# EAGLE design snc98_Display_15x7-Seg_3-digit_LTD040 (EAGLE 6.6.0)

## Sheet 1 of 2
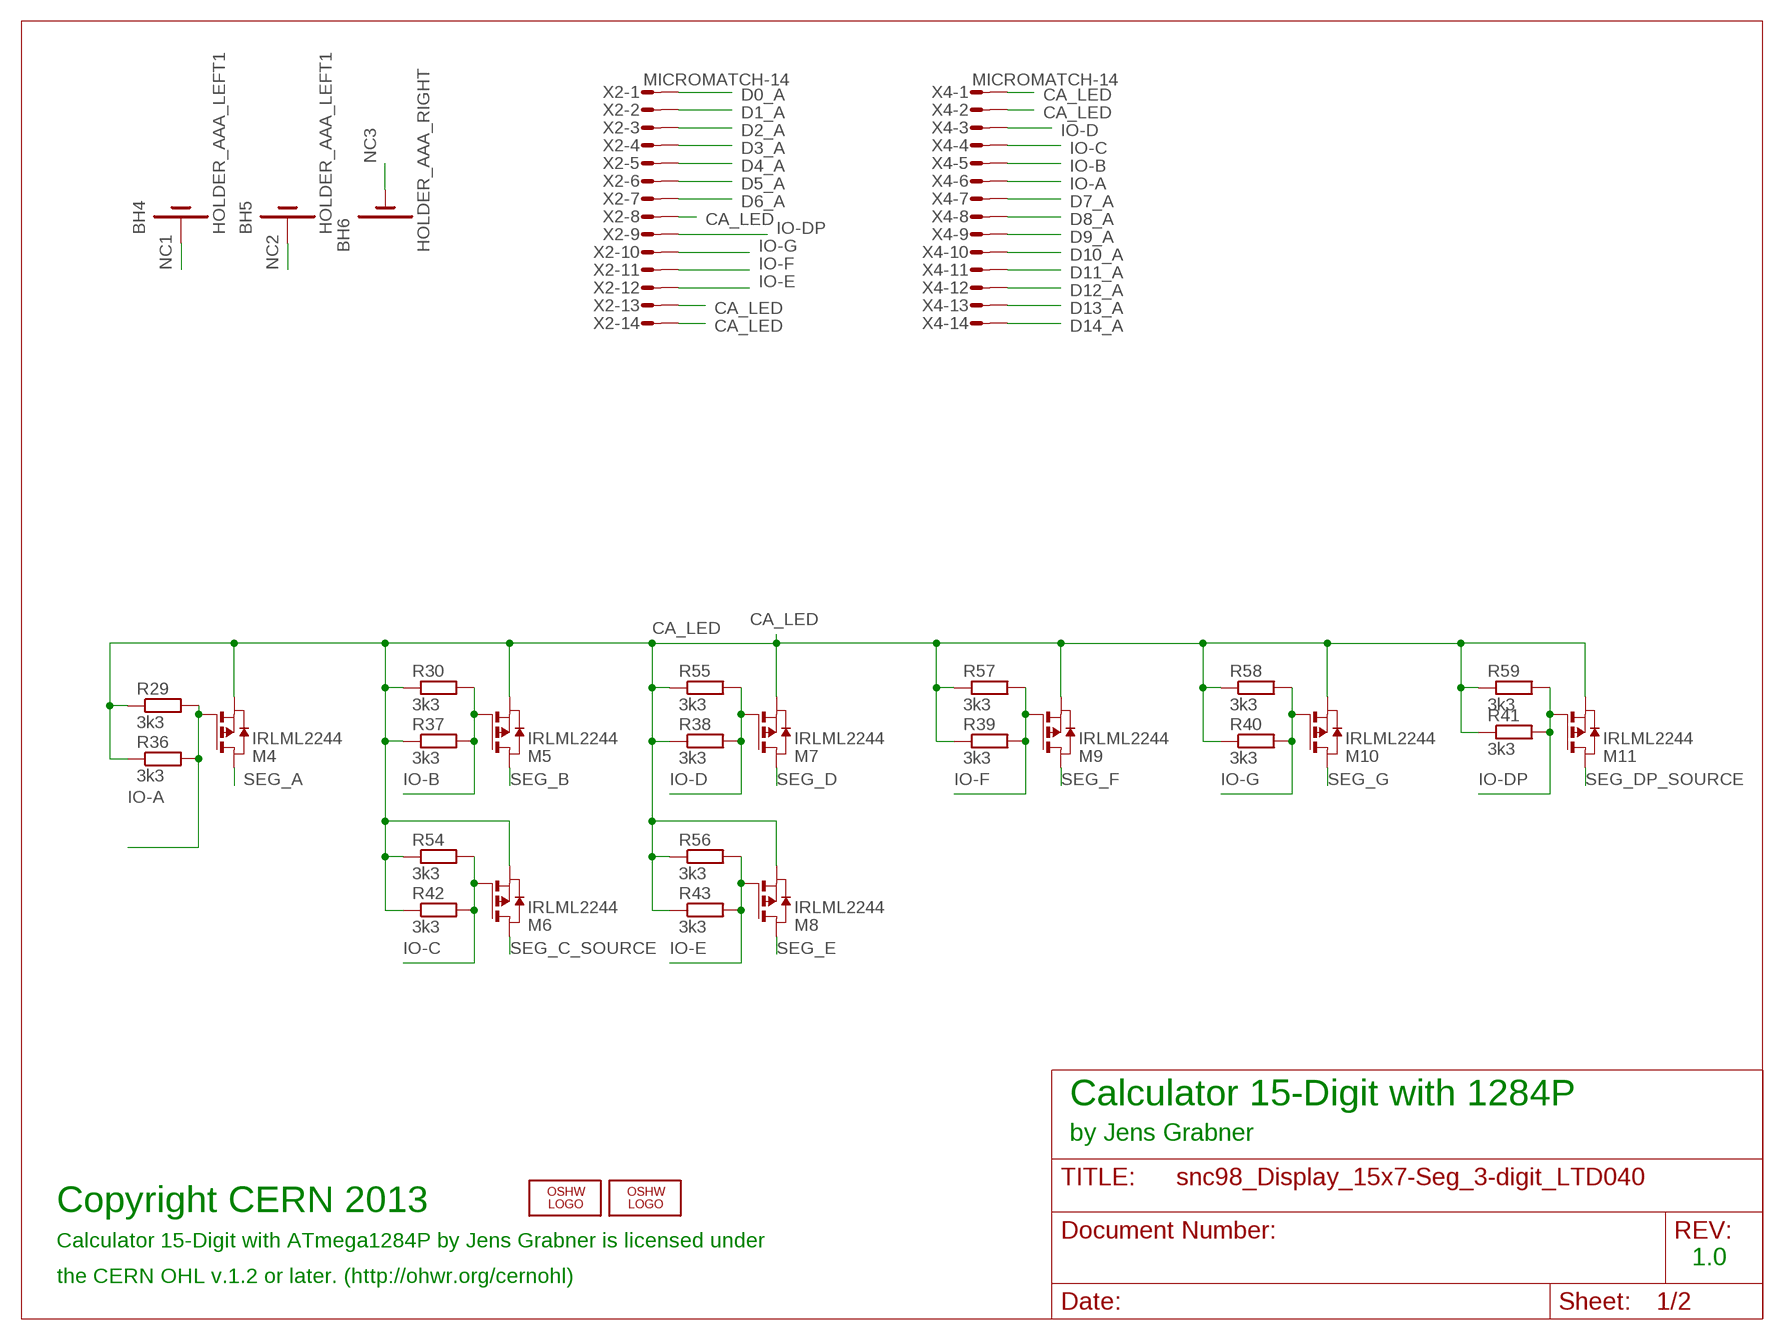
[diagram p0: schematic, sheet 1]

### Parts
BH4  HOLDER_AAA_LEFT1  [BATTERY-AAA-LEFT]
BH5  HOLDER_AAA_LEFT1  [BATTERY-AAA-LEFT]
BH6  HOLDER_AAA_RIGHT  [BATTERY-AAA-RIGHT]
LOGO1  OSHW_LOGO_8MILX0150-NT  [OSHW_8X150_NOTEXT]
LOGO3  OSHW_LOGO_6MILX0100-NT  [OSHW_6X100_NOTEXT]
M4  IRLML2244  IRLML6402  [SOT-23]
M5  IRLML2244  IRLML6402  [SOT-23]
M6  IRLML2244  IRLML6402  [SOT-23]
M7  IRLML2244  IRLML6402  [SOT-23]
M8  IRLML2244  IRLML6402  [SOT-23]
M9  IRLML2244  IRLML6402  [SOT-23]
M10  IRLML2244  IRLML6402  [SOT-23]
M11  IRLML2244  IRLML6402  [SOT-23]
R29  3k3  R-EU_0204/5  [0204/5]
R30  3k3  R-EU_0204/5  [0204/5]
R36  3k3  R-EU_R1206  [R1206]
R37  3k3  R-EU_R1206  [R1206]
R38  3k3  R-EU_R1206  [R1206]
R39  3k3  R-EU_R1206  [R1206]
R40  3k3  R-EU_R1206  [R1206]
R41  3k3  R-EU_R1206  [R1206]
R42  3k3  R-EU_R1206  [R1206]
R43  3k3  R-EU_R1206  [R1206]
R54  3k3  R-EU_0204/5  [0204/5]
R55  3k3  R-EU_0204/5  [0204/5]
R56  3k3  R-EU_0204/5  [0204/5]
R57  3k3  R-EU_0204/5  [0204/5]
R58  3k3  R-EU_0204/5  [0204/5]
R59  3k3  R-EU_0204/5  [0204/5]
X2  MICROMATCH-14  [MICROMATCH-14]
X4  MICROMATCH-14  [MICROMATCH-14]

### Nets
CA_LED: M4.2(S) M5.2(S) M6.2(S) M7.2(S) M8.2(S) M9.2(S) M10.2(S) M11.2(S) R29.1 R30.1 R36.1 R37.1 R38.1 R39.1 R40.1 R41.1 R42.1 R43.1 R54.1 R55.1 R56.1 R57.1 R58.1 R59.1 X2.8 X2.13 X2.14 X4.1 X4.2 ; also sheet 2
D0_A: X2.1 ; also sheet 2
D1_A: X2.2 ; also sheet 2
D2_A: X2.3 ; also sheet 2
D3_A: X2.4 ; also sheet 2
D4_A: X2.5 ; also sheet 2
D5_A: X2.6 ; also sheet 2
D6_A: X2.7 ; also sheet 2
D7_A: X4.7 ; also sheet 2
D8_A: X4.8 ; also sheet 2
D9_A: X4.9 ; also sheet 2
D10_A: X4.10 ; also sheet 2
D11_A: X4.11 ; also sheet 2
D12_A: X4.12 ; also sheet 2
D13_A: X4.13 ; also sheet 2
D14_A: X4.14 ; also sheet 2
IO-A: M4.1(G) R29.2 R36.2 X4.6 ; also sheet 2
IO-B: M5.1(G) R30.2 R37.2 X4.5 ; also sheet 2
IO-C: M6.1(G) R42.2 R54.2 X4.4 ; also sheet 2
IO-D: M7.1(G) R38.2 R55.2 X4.3 ; also sheet 2
IO-DP: M11.1(G) R41.2 R59.2 X2.9 ; also sheet 2
IO-E: M8.1(G) R43.2 R56.2 X2.12 ; also sheet 2
IO-F: M9.1(G) R39.2 R57.2 X2.11 ; also sheet 2
IO-G: M10.1(G) R40.2 R58.2 X2.10 ; also sheet 2
NC1: BH4.P1(+) BH4.P2(+) BH4.P3(+) BH4.P4(+)
NC2: BH5.P1(+) BH5.P2(+) BH5.P3(+) BH5.P4(+)
NC3: BH6.M1(-) BH6.M2(-) BH6.M3(-) BH6.M4(-)
SEG_A: M4.3(D) ; also sheet 2
SEG_B: M5.3(D) ; also sheet 2
SEG_C_SOURCE: M6.3(D) ; also sheet 2
SEG_D: M7.3(D) ; also sheet 2
SEG_DP_SOURCE: M11.3(D) ; also sheet 2
SEG_E: M8.3(D) ; also sheet 2
SEG_F: M9.3(D) ; also sheet 2
SEG_G: M10.3(D) ; also sheet 2

### Notes on the sheet
- Calculator 15-Digit with 1284P
- by Jens Grabner
- Copyright CERN 2013
- Calculator 15-Digit with ATmega1284P by Jens Grabner is licensed under
- 1.0
- the CERN OHL v.1.2 or later. (http://ohwr.org/cernohl)

## Sheet 2 of 2
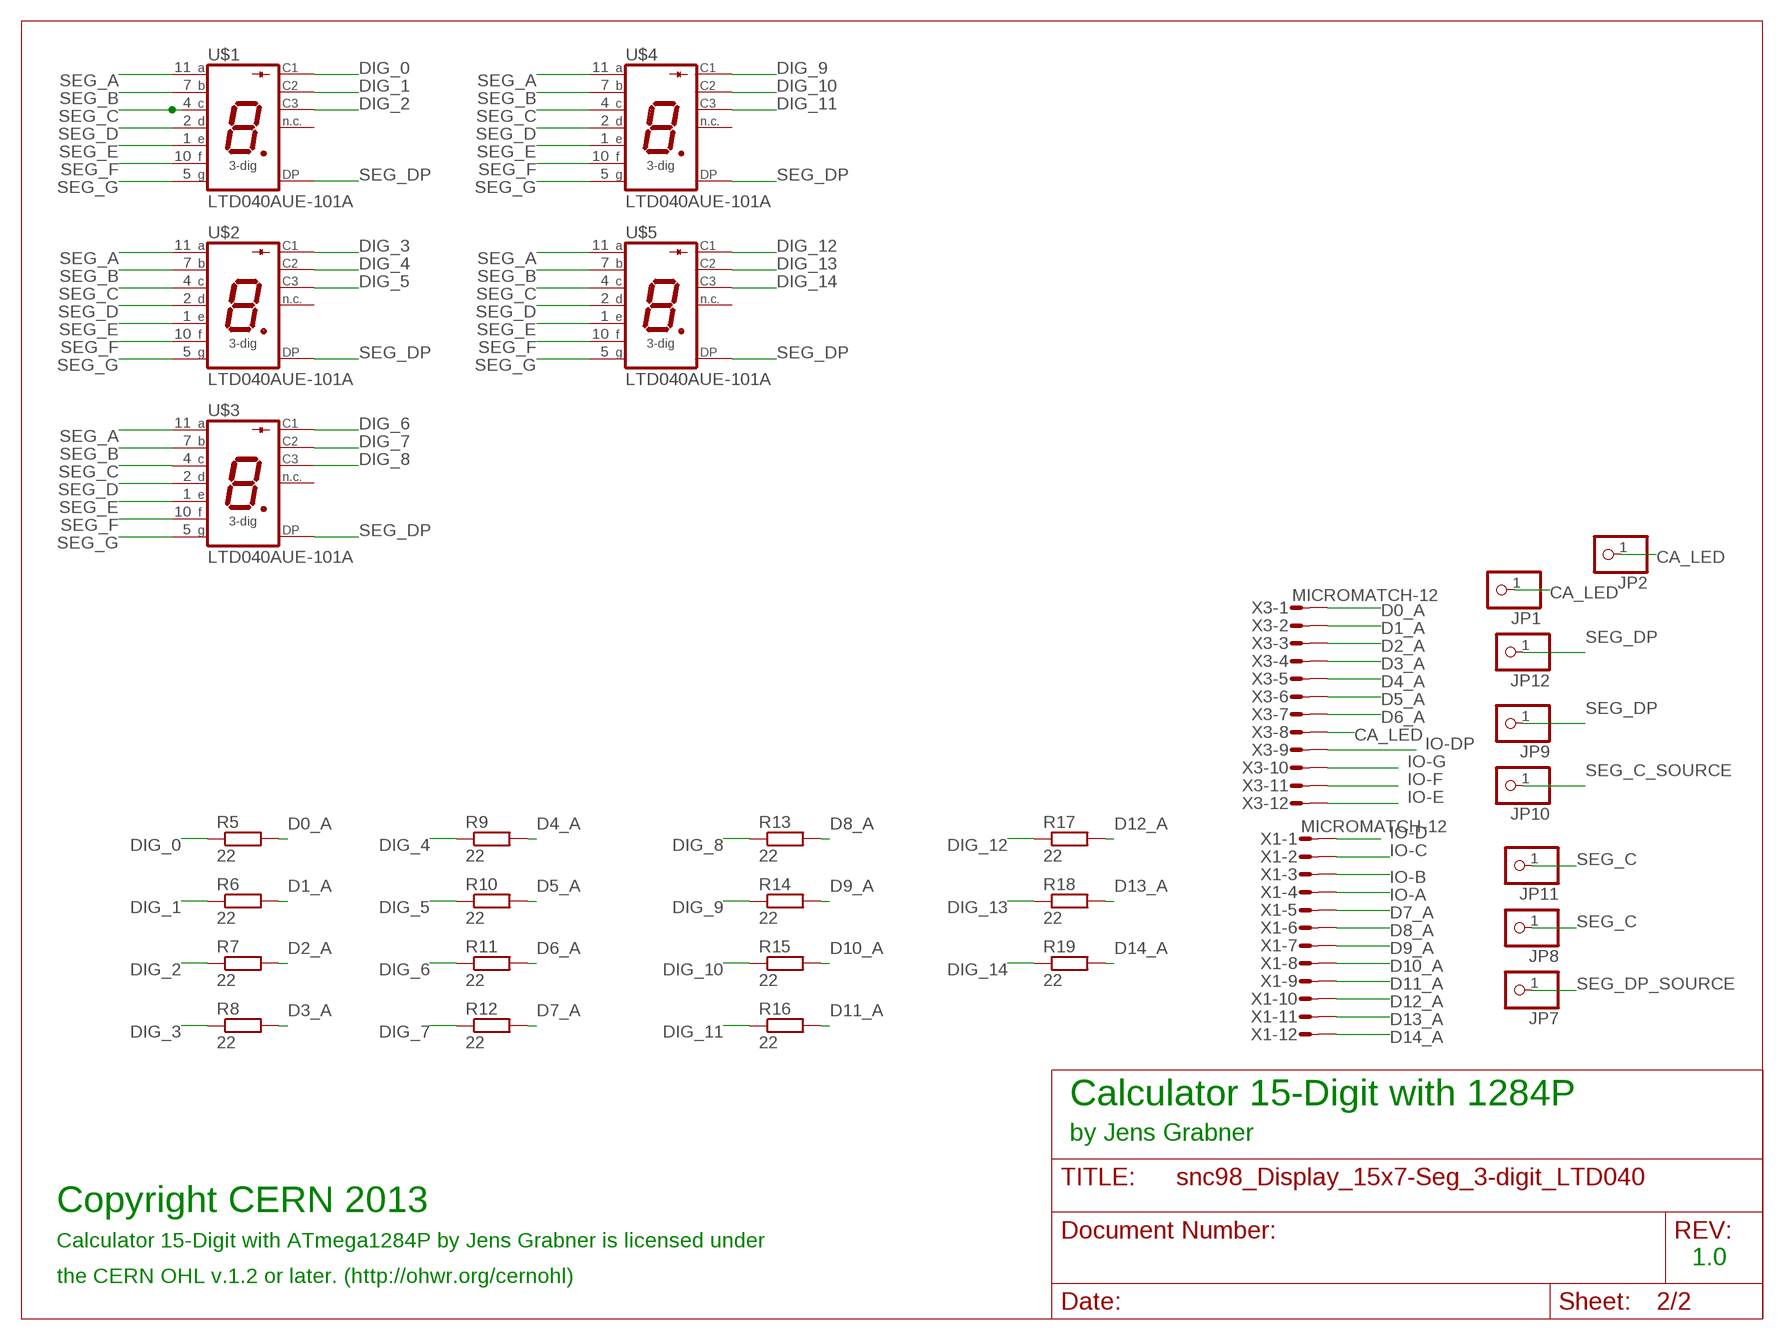
[diagram p1: schematic, sheet 2]

### Parts
JP1  PINHD-1X1  [1X01]
JP2  PINHD-1X1  [1X01]
JP7  PINHD-1X1  [1X01]
JP8  PINHD-1X1  [1X01]
JP9  PINHD-1X1  [1X01]
JP10  PINHD-1X1  [1X01]
JP11  PINHD-1X1  [1X01]
JP12  PINHD-1X1  [1X01]
R5  22  R-EU_R1210  [R1210]
R6  22  R-EU_R1210  [R1210]
R7  22  R-EU_R1210  [R1210]
R8  22  R-EU_R1210  [R1210]
R9  22  R-EU_R1210  [R1210]
R10  22  R-EU_R1210  [R1210]
R11  22  R-EU_R1210  [R1210]
R12  22  R-EU_R1210  [R1210]
R13  22  R-EU_R1210  [R1210]
R14  22  R-EU_R1210  [R1210]
R15  22  R-EU_R1210  [R1210]
R16  22  R-EU_R1210  [R1210]
R17  22  R-EU_R1210  [R1210]
R18  22  R-EU_R1210  [R1210]
R19  22  R-EU_R1210  [R1210]
U$1  LTD040AUE-101A  [LTD040AUE-101A]
U$2  LTD040AUE-101A  [LTD040AUE-101A]
U$3  LTD040AUE-101A  [LTD040AUE-101A]
U$4  LTD040AUE-101A  [LTD040AUE-101A]
U$5  LTD040AUE-101A  [LTD040AUE-101A]
X1  MICROMATCH-12  [MICROMATCH-12]
X3  MICROMATCH-12  [MICROMATCH-12]

### Nets
CA_LED: JP1.1 JP2.1 X3.8 ; also sheet 1
D0_A: R5.2 X3.1 ; also sheet 1
D1_A: R6.2 X3.2 ; also sheet 1
D2_A: R7.2 X3.3 ; also sheet 1
D3_A: R8.2 X3.4 ; also sheet 1
D4_A: R9.2 X3.5 ; also sheet 1
D5_A: R10.2 X3.6 ; also sheet 1
D6_A: R11.2 X3.7 ; also sheet 1
D7_A: R12.2 X1.5 ; also sheet 1
D8_A: R13.2 X1.6 ; also sheet 1
D9_A: R14.2 X1.7 ; also sheet 1
D10_A: R15.2 X1.8 ; also sheet 1
D11_A: R16.2 X1.9 ; also sheet 1
D12_A: R17.2 X1.10 ; also sheet 1
D13_A: R18.2 X1.11 ; also sheet 1
D14_A: R19.2 X1.12 ; also sheet 1
DIG_0: R5.1 U$1.12(C1)
DIG_1: R6.1 U$1.9(C2)
DIG_2: R7.1 U$1.8(C3)
DIG_3: R8.1 U$2.12(C1)
DIG_4: R9.1 U$2.9(C2)
DIG_5: R10.1 U$2.8(C3)
DIG_6: R11.1 U$3.12(C1)
DIG_7: R12.1 U$3.9(C2)
DIG_8: R13.1 U$3.8(C3)
DIG_9: R14.1 U$4.12(C1)
DIG_10: R15.1 U$4.9(C2)
DIG_11: R16.1 U$4.8(C3)
DIG_12: R17.1 U$5.12(C1)
DIG_13: R18.1 U$5.9(C2)
DIG_14: R19.1 U$5.8(C3)
IO-A: X1.4 ; also sheet 1
IO-B: X1.3 ; also sheet 1
IO-C: X1.2 ; also sheet 1
IO-D: X1.1 ; also sheet 1
IO-DP: X3.9 ; also sheet 1
IO-E: X3.12 ; also sheet 1
IO-F: X3.11 ; also sheet 1
IO-G: X3.10 ; also sheet 1
SEG_A: U$1.11(A) U$2.11(A) U$3.11(A) U$4.11(A) U$5.11(A) ; also sheet 1
SEG_B: U$1.7(B) U$2.7(B) U$3.7(B) U$4.7(B) U$5.7(B) ; also sheet 1
SEG_C: JP8.1 JP11.1 U$1.4(C) U$2.4(C) U$3.4(C) U$4.4(C) U$5.4(C)
SEG_C_SOURCE: JP10.1 ; also sheet 1
SEG_D: U$1.2(D) U$2.2(D) U$3.2(D) U$4.2(D) U$5.2(D) ; also sheet 1
SEG_DP: JP9.1 JP12.1 U$1.3(DP) U$2.3(DP) U$3.3(DP) U$4.3(DP) U$5.3(DP)
SEG_DP_SOURCE: JP7.1 ; also sheet 1
SEG_E: U$1.1(E) U$2.1(E) U$3.1(E) U$4.1(E) U$5.1(E) ; also sheet 1
SEG_F: U$1.10(F) U$2.10(F) U$3.10(F) U$4.10(F) U$5.10(F) ; also sheet 1
SEG_G: U$1.5(G) U$2.5(G) U$3.5(G) U$4.5(G) U$5.5(G) ; also sheet 1
Unconnected: U$1.6 U$2.6 U$3.6 U$4.6 U$5.6

### Notes on the sheet
- Calculator 15-Digit with 1284P
- by Jens Grabner
- Copyright CERN 2013
- Calculator 15-Digit with ATmega1284P by Jens Grabner is licensed under
- 1.0
- the CERN OHL v.1.2 or later. (http://ohwr.org/cernohl)

## Library data of the parts
BH4 BH5 = SparkFun-Electromechanical:HOLDER_AAA_LEFT
BH6 = SparkFun-Electromechanical:HOLDER_AAA_RIGHT
JP1 JP2 JP7-JP12 = adafruit:PINHD-1X1: Pin header 1x1 for 0.1" spacing With round pins
LOGO1 = ohw-logo:OSHW_LOGO_8MIL
LOGO3 = ohw-logo:OSHW_LOGO_6MIL
M4-M11 = IRLML6402:IRLML6402
R5-R19 R29 R30 R36-R43 R54-R59 = rcl:R-EU_: RESISTOR, European symbol
U$1-U$5 = display_LTD:LTD040AUE-101A: LTD040AUE-101A
X1 X3 = Con-amp-micromatch:MICROMATCH-12: MicroMaTch 12 8-215464-2 / 1-215464-2 Drawing Number C-215464 DDEController.pdf; MF: FARNELL; MPN: 8-215464-2; OC_FARNELL: 3784666; OC_NEWARK: 95H9857
X2 X4 = Con-amp-micromatch:MICROMATCH-14: MicroMaTch 14 8-215464-4 / 1-215464-4 Drawing Number C-215464 DDEController.pdf; MF: FARNELL; MPN: 8-215464-4; OC_FARNELL: 3784678; OC_NEWARK: 19J6431

## Board
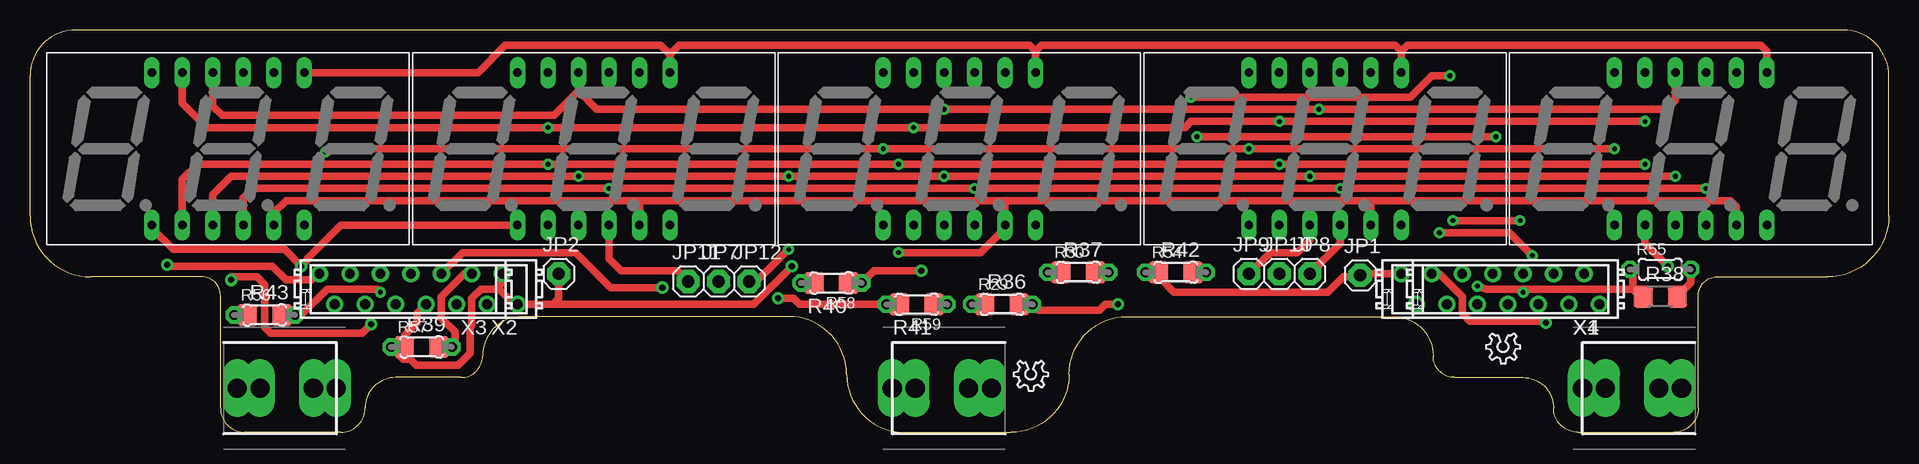
[diagram p2: board, top side]
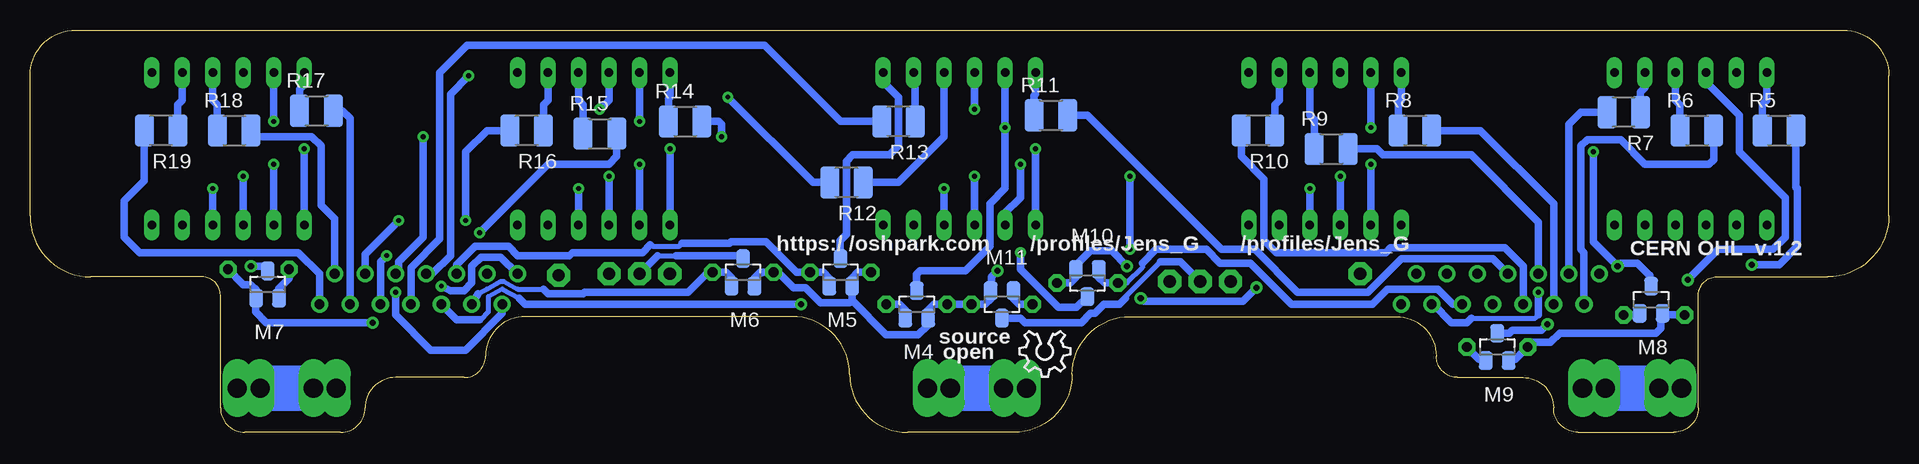
[diagram p3: board, bottom side, seen from below]

Size 154.94 x 33.53 mm. Coordinates in mm from the lower left corner, seen from the top.
Outline: 154.94,29.72 arc90 151.13,33.53 3.81,33.53 arc90 0,29.72 0,18.03 arc90 5.08,12.95 14.35,12.95 arc-90 15.88,11.43 15.88,2.03 arc90 17.91,0 25.91,0 arc90 27.94,2.03 arc-90 30.48,4.57 35.94,4.57 arc90 37.72,6.35 arc-90 41.02,9.65 63.25,9.65 arc-90 68.07,4.83 arc90 72.9,0 81.79,0 arc90 86.61,4.83 arc-90 91.44,9.65 113.67,9.65 arc-90 116.97,6.35 arc90 118.75,4.57 124.46,4.57 arc-90 127,2.03 arc90 129.03,0 137.03,0 arc90 139.06,2.03 139.06,11.43 arc-90 140.59,12.95 149.86,12.95 arc90 154.94,18.03 154.94,29.72
Copper layers (1*16): Top 0.035mm / dielectric 1.5mm / Bottom 0.035mm
Design rules "OSHPark-8mil-2layer": minimum track width 10mil, minimum drill 15mil, track to track 8mil, track to pad 8mil, pad to pad 8mil, via to via 8mil, smd to smd 8mil, copper to edge 8mil, drill to drill 8mil, minimum pad ring 12mil, minimum via ring 10mil, stop-mask expansion 4mil, vias tented up to drill 20mil, thermal gap 10mil

### Footprints (pad centres in the part's own frame; a part is rotated, then mirrored left to right if it is on the bottom)
BATTERY-AAA-LEFT = drill 1.6 long: P1 -2.413,0; P2 3.937,0; P3 2.032,0; P4 -4.318,0
BATTERY-AAA-RIGHT = drill 1.6 long: M1 -3.937,0; M2 2.413,0; M3 4.318,0; M4 -2.032,0
1X01 = drill 1.016 pad 1.93 octagon: 1 0,0
SOT-23 = smd 1.143 x 1.524: 1 0.953,1.143; 2 -0.953,1.143; 3 0,-1.143
R1210 = smd 1.6 x 2.7: 1 -1.4,0; 2 1.4,0
0204/5 = drill 0.813 octagon: 1 -2.54,0; 2 2.54,0
R1206 = smd 1.6 x 1.803: 1 -1.422,0; 2 1.422,0
LTD040AUE-101A = drill 0.7 pad 1.27 long: 1 -6.35,-6.35; 2 -3.81,-6.35; 3 -1.27,-6.35; 4 1.27,-6.35; 5 3.81,-6.35; 6 6.35,-6.35; 8 3.81,6.35; 9 1.27,6.35; 10 -1.27,6.35; 11 -3.81,6.35; 12 -6.35,6.35 | drill 0.7 long: 7 6.35,6.35
MICROMATCH-12 = drill 0.813: 1 6.985,-1.27; 2 5.715,1.27; 3 4.445,-1.27; 4 3.175,1.27; 5 1.905,-1.27; 6 0.635,1.27; 7 -0.635,-1.27; 8 -1.905,1.27; 9 -3.175,-1.27; 10 -4.445,1.27; 11 -5.715,-1.27; 12 -6.985,1.27
MICROMATCH-14 = drill 0.813: 1 8.255,-1.27; 2 6.985,1.27; 3 5.715,-1.27; 4 4.445,1.27; 5 3.175,-1.27; 6 1.905,1.27; 7 0.635,-1.27; 8 -0.635,1.27; 9 -1.905,-1.27; 10 -3.175,1.27; 11 -4.445,-1.27; 12 -5.715,1.27; 13 -6.985,-1.27; 14 -8.255,1.27

### Placement (x,y rotation side)
BH4  133.73,3.68 0 top
BH5  76.2,3.68 0 top
BH6  21.21,3.68 0 top
JP1  110.87,13.08 0 top
JP2  44.07,13.21 0 top
JP7  57.4,12.57 0 top
JP8  106.68,13.21 0 top
JP9  101.6,13.21 0 top
JP10  104.14,13.21 0 top
JP11  54.86,12.57 0 top
JP12  59.94,12.57 0 top
LOGO1  68.22,8.43 180 bottom
LOGO2  OSHW_LOGO_6MILX0100-NT  [OSHW_6X100_NOTEXT]  84.84,5.97 180 top
LOGO3  124.21,8.26 180 top
M4  81.03,10.67 180 bottom
M5  87.38,13.34 180 bottom
M6  95.5,13.34 180 bottom
M7  135.13,12.32 180 bottom
M8  19.81,11.05 180 bottom
M9  32.64,7.11 180 bottom
M10  66.8,12.45 0 bottom
M11  73.91,10.67 0 bottom
R5  9.14,25.15 0 bottom
R6  16,25.15 0 bottom
R7  22.1,26.67 180 bottom
R8  39.5,25.15 0 bottom
R9  46.48,23.62 0 bottom
R10  52.58,25.15 180 bottom
R11  69.85,26.42 0 bottom
R12  86.87,20.83 180 bottom
R13  82.55,25.91 180 bottom
R14  100.33,25.91 0 bottom
R15  107.44,24.89 0 bottom
R16  113.54,25.15 180 bottom
R17  131.06,26.8 0 bottom
R18  137.92,25.15 0 bottom
R19  144.02,25.15 180 bottom
R29  81.03,10.67 0 top
R30  87.38,13.34 0 top
R36  81.03,10.67 0 top
R37  87.38,13.34 0 top
R38  135.89,11.3 0 top
R39  32.64,7.11 0 top
R40  66.8,12.45 180 top
R41  73.91,10.67 180 top
R42  95.5,13.34 0 top
R43  19.56,9.78 0 top
R54  95.5,13.34 0 top
R55  135.89,13.59 0 top
R56  19.56,9.78 0 top
R57  32.64,7.11 0 top
R58  66.8,12.45 180 top
R59  73.91,10.67 180 top
U$1  16.51,23.62 0 top
U$2  46.99,23.62 0 top
U$3  77.47,23.62 0 top
U$4  107.95,23.62 0 top
U$5  138.43,23.62 0 top
X1  123.83,11.94 180 top
X2  32.38,11.94 180 top
X3  31.11,11.94 180 top
X4  122.56,11.94 180 top

### Tracks (layer width: path | path; a pad name or v marks a point on that pad's centre or on a via)
CA_LED  (via drill 0.41, 0.51)
  Top 0.254: 31.75,7.62 R39.1
  Top 0.406: 36.2,6.22 36.2,6.1 | 107.31,11.81 107.31,11.68
  Top 0.61: R43.1 R56.1 | 43.56,10.67 60.33,10.67 v63.5,13.84 | 43.56,10.67 X2.14 40.39,10.67 38.99,12.06 | R36.1 R29.1 | R37.1 85.95,13.36 85.85,13.46 84.96,13.46 R30.1 | R54.1 93.7,13.31 R42.1 94.25,13.17 94.25,12.79 95.36,11.68 107.31,11.68 108.2,11.68 109.47,12.95 110.24,12.95 | X4.1 110.24,13.21 110.24,12.95 | 38.99,12.06 39.37,12.45 X2.13 | 38.99,12.06 38.86,11.94 37.59,11.94 36.83,11.18 36.83,8.89 36.7,8.76 36.7,6.6 36.2,6.1 35.69,5.59 32.21,5.59 31.7,6.1 31.11,6.1 R57.1 R39.1 | JP2.1 44.07,11.18 43.56,10.67 | R58.1 R40.1 | R58.1 68.76,12.45 | 31.7,6.63 R39.1 | 31.11,7.21 R39.1 | R41.1 R59.1 | v74.3,13.46 70.36,13.46 R58.1 | v124.46,11.68 124.33,11.94 | 124.33,11.94 121.41,11.94 v120.65,12.19 | 110.24,12.95 110.74,12.95 JP1.1 | X2.8 32.26,9.91 32.26,9.12 31.24,8.11 31.24,7.14 R39.1 | 124.33,11.94 133.6,11.94 | 133.6,11.94 133.86,11.68 134.09,11.68 R38.1 | 133.6,11.94 133.6,13.34 R55.1
  Bottom 0.254: M8.2 18.39,9.91 18.39,9.78
  Bottom 0.61: M8.2 19,9.7 19,8.69 19.43,8.26 27.43,8.26 28.19,7.49 29.72,7.49 R57.1 31.11,6.1 M9.2 | v63.5,13.84 64.77,15.11 66.55,15.11 67.74,13.92 M10.2 67.74,12.93 R40.1 R58.1 68.33,12.45 | 18.62,9.78 18.39,9.78 R56.1 | R30.1 R37.1 86.44,12.85 M5.2 86.44,12.31 86.44,11 | 86.44,11 83.57,8.13 80.9,8.13 80.14,8.89 80.14,9.6 M4.2 80.09,10.19 R36.1 R29.1 R59.1 R41.1 74.85,11.15 M11.2 74.8,11.73 74.8,12.95 v74.3,13.46 | 93.93,13.28 R54.1 | 86.44,11 86.64,10.79 89.03,10.79 90.3,12.06 91.31,12.06 92.58,13.34 R54.1 | v120.65,12.19 119.89,11.81 118.75,11.81 118.11,12.45 118.11,13.84 117.35,14.61 115.7,14.61 X4.1 | v124.46,11.68 124.46,9.78 121.54,6.86 118.62,6.86 115.57,9.91 X4.2 | 134.11,11.3 M7.2 134.21,11.3 134.21,11.96 133.35,12.83 R55.1 | M6.2 94.55,12.87 R42.1 R54.1
D0_A  (via drill 0.51)
  Top 0.406: 23.88,12.95 23.75,12.95
  Top 0.61: v11.43,13.97 11.56,13.84 20.19,13.84 21.34,12.7 23.5,12.7 23.75,12.95 24,13.21 X2.1
  Bottom 0.61: v11.43,13.97 9.14,13.97 7.62,15.49 7.62,20.32 7.74,20.44 R5.2
D1_A
  Bottom 0.61: R6.2 14.6,22.74 14.99,22.35 20.32,22.35 22.35,24.38 25.15,24.38 25.65,23.88 25.65,15.24 25.4,14.99 X2.2
D2_A
  Bottom 0.61: 23.5,26.03 R7.2 25.65,26.67 26.67,25.65 X2.3
D3_A
  Bottom 0.61: R8.2 34.04,25.15 27.94,19.05 X2.4
D4_A
  Bottom 0.61: R9.2 42.67,23.62 42.16,23.11 34.8,23.11 29.21,17.53 X2.5
D5_A
  Bottom 0.61: R10.2 53.98,22.99 52.07,21.08 52.07,16 51.05,14.99 41.91,14.99 41.53,15.37 32,15.37 30.48,13.84 X2.6
D6_A
  Bottom 0.61: X2.7 33.02,14.48 40.64,14.48 43.43,11.68 49.28,11.68 52.83,15.24 55.63,15.24 66.8,26.42 R11.2
D7_A  (via drill 0.41)
  Top 0.61: v118.36,29.72 116.84,29.72 115.06,27.94 v96.77,27.94
  Bottom 0.61: v118.36,29.72 119.89,28.19 119.89,14.73 121.41,13.21 X4.7 | v96.77,27.94 89.66,20.83 R12.2
D8_A
  Bottom 0.61: R13.2 87.38,25.91 93.73,32.26 118.49,32.26 120.78,29.97 120.78,16.13 123.19,13.72 X4.8
D9_A  (via drill 0.41)
  Top 0.61: v122.17,24.64 v97.28,24.64
  Bottom 0.61: v122.17,24.64 122.17,16.26 124.21,14.22 124.21,13.46 X4.9 | 98.93,25.78 R14.2 97.54,25.91 97.28,25.65 v97.28,24.64
D10_A  (via drill 0.41)
  Top 0.61: v117.47,16.64 123.32,16.64 v125.22,14.73
  Bottom 0.61: X4.10 125.73,14.22 v125.22,14.73 | R15.2 106.04,22.99 106.68,22.35 111.76,22.35 v117.47,16.64
D11_A  (via drill 0.41)
  Top 0.61: v124.21,17.65 v118.62,17.65
  Bottom 0.61: 115.06,25.27 R16.2 116.84,25.15 118.62,23.37 v118.62,17.65 | X4.11 127,14.86 v124.21,17.65
D12_A
  Bottom 0.61: X4.12 128.27,26.16 128.91,26.8 R17.2
D13_A
  Bottom 0.61: 136.4,25.15 R18.2 136.01,24.64 131.44,24.64 130.68,23.88 130.68,18.92 129.54,17.78 X4.13
D14_A
  Bottom 0.61: R19.2 145.42,20.95 147.07,19.3 147.07,16.26 145.8,14.99 132.59,14.99 130.81,13.21 X4.14
DIG_0
  Bottom 0.61: R5.1 10.54,27.3 10.16,27.69 U$1.12
DIG_1
  Bottom 0.61: R6.1 17.4,27.31 17.78,27.69 U$1.9
DIG_2
  Bottom 0.61: R7.1 20.7,28.32 20.32,28.7 U$1.8
DIG_3
  Bottom 0.61: R8.1 40.9,27.43 40.64,27.69 U$2.12
DIG_4
  Bottom 0.61: R9.1 47.88,26.04 48.26,26.42 U$2.9
DIG_5
  Bottom 0.61: R10.1 51.18,27.31 50.8,27.69 U$2.8
DIG_6
  Bottom 0.61: R11.1 71.25,28.06 71.12,28.19 U$3.12
DIG_7
  Bottom 0.61: U$3.9 78.74,24.64 82.55,20.83 R12.1
DIG_8
  Bottom 0.61: R13.1 81.15,29.84 U$3.8
DIG_9
  Bottom 0.61: R14.1 101.73,27.81 101.6,27.94 U$4.12
DIG_10
  Bottom 0.61: R15.1 108.84,27.31 109.22,27.69 U$4.9
DIG_11
  Bottom 0.61: R16.1 112.14,27.31 111.76,27.69 U$4.8
DIG_12
  Bottom 0.61: 132.08,25.91 132.21,26.04 132.21,26.54 R17.1 132.46,28.57 132.08,28.96 U$5.12
DIG_13
  Bottom 0.61: R18.1 139.32,27.31 139.7,27.69 U$5.9
DIG_14
  Bottom 0.61: R19.1 142.62,27.31 142.24,27.69 U$5.8
IO-A  (via drill 0.51)
  Top 0.61: R36.2 R29.2 84.07,10.16 89.15,10.16 89.66,10.67 v90.68,10.67
  Bottom 0.406: 114.17,11.18 115.57,11.94 116.71,11.3 116.71,10.03 117.35,9.4 117.47,9.4
  Bottom 0.61: M4.1 81.97,10.19 R36.2 R29.2 | v90.68,10.67 113.67,10.67 114.17,11.18 | 117.47,9.4 119.38,9.4 X4.6
IO-B
  Top 0.61: R37.2 R30.2
  Bottom 0.406: 103.25,15.62 103.12,15.62 103,15.49 100.84,15.49 100.58,15.75
  Bottom 0.61: M5.1 88.32,12.85 R37.2 R30.2 91.06,13.34 93.6,15.88 96.52,15.88 96.65,15.75 100.58,15.75 | 103.25,15.62 103.89,14.99 109.73,14.99 109.98,14.73 114.3,14.73 115.06,15.49 117.86,15.49 119.38,13.97 X4.5
IO-C
  Top 0.61: R42.2 97.56,13.31 R54.2
  Bottom 0.406: 117.6,11.56 116.84,11.94 115.7,12.57 115.44,12.57 114.3,11.94 112.14,11.94
  Bottom 0.61: 97.66,13.31 98.06,13.31 | 98.06,13.31 98.15,13.31 R54.2 R42.2 96.46,12.87 M6.1 | 98.06,13.31 98.57,13.19 100.08,11.68 108.71,11.68 108.84,11.56 111.76,11.56 112.14,11.94 | 117.6,11.56 X4.4
IO-D  (via drill 0.51 pad 0.25)
  Top 0.61: X4.3 117.47,13.21 119.38,11.3 119.38,9.91 120.02,9.27 126.24,9.27 v126.36,9.14 | R38.2 137.31,11.33 138.43,12.45 R55.2
  Bottom 0.61: v126.36,9.14 135.25,9.14 136.14,10.03 136.14,10.72 136.19,11.3 M7.1 136.08,11.87 136.53,12.32 137.16,12.32 R55.2 138.3,13.46
IO-DP  (via drill 0.51, 0.51 pad 0.25)
  Top 0.61: R41.2 R59.2 64.14,10.67 63.63,11.18 v62.36,11.18 | v52.7,12.06 48.39,12.06 45.47,14.99 36.07,14.99 X2.9
  Bottom 0.61: R59.2 R41.2 72.96,11.14 M11.1 | v62.36,11.18 62.1,10.92 53.85,10.92 v52.7,12.06
IO-E  (via drill 0.4)
  Top 0.61: R43.2 R56.2 22.48,9.91 22.73,9.91 24.77,11.94 28.96,11.94 v29.21,11.68
  Bottom 0.406: 34.8,9.53 29.46,9.53 29.21,9.78
  Bottom 0.61: R56.2 21.26,9.78 M8.1 | 34.8,9.53 35.18,9.14 36.45,9.14 37.97,10.67 X2.12 | 29.21,9.78 v29.21,11.68
IO-F
  Top 0.61: R39.2 R57.2 35.43,7.37 35.43,8.38 34.29,9.53 34.29,11.3 36.2,13.21 X2.11
  Bottom 0.61: M9.1 34.16,6.1 R57.2
IO-G
  Top 0.61: R40.2 R58.2
  Bottom 0.406: R58.2 63.5,12.45 62.23,13.72 62.23,14.1
  Bottom 0.61: 62.23,14.1 61.09,15.24 56.9,15.24 55.75,14.1 53.21,14.1 49.78,10.67 43.05,10.67 41.78,11.94 37.59,11.94 36.32,10.67 X2.10 | M10.1 65.86,12.93 R40.2 R58.2
NC1
  Bottom 0.406: 137.54,3.68 BH4.P2
  Bottom 2.184: 131.19,3.68 BH4.P4 | BH4.P3 137.54,3.68
  Bottom 3.81: 131.19,3.68 BH4.P1 BH4.P3
NC2
  Bottom 0.254: 80.01,3.68 BH5.P2
  Bottom 2.184: 73.66,3.68 BH5.P4 | BH5.P3 80.01,3.68
  Bottom 3.81: 73.66,3.68 BH5.P1 BH5.P3
NC3
  Bottom 0.254: BH6.M1 17.78,3.68
  Bottom 2.184: 17.4,3.68 17.78,3.68 BH6.M4 | 23.75,3.68 BH6.M3
  Bottom 3.81: BH6.M4 22.86,3.68 BH6.M2 23.75,3.68
SEG_A  (via drill 0.41)
  Top 0.61: v134.62,25.91 v104.14,25.91 96.77,25.91 96.27,25.4 v73.66,25.4 v43.18,25.4 14.73,25.4 12.7,27.43 U$1.11
  Bottom 0.61: M4.3 81.05,11.71 81.05,13.18 80.77,13.46 76.96,13.46 74.93,15.49 74.93,19.05 73.66,20.32 v73.66,25.4 U$3.11 | v43.18,25.4 U$2.11 | v104.14,25.91 U$4.11 | U$5.11 v134.62,25.91
SEG_B
  Top 0.61: U$1.7 37.34,29.97 39.62,32.26 52.58,32.26 53.34,31.5 | U$2.7 53.34,31.5 | 53.34,31.5 54.1,32.26 83.31,32.26 83.82,31.75 | 83.82,31.75 U$3.7 | U$4.7 114.3,31.75 | 114.3,31.75 113.79,32.26 84.33,32.26 83.82,31.75 | U$5.7 144.78,31.75 144.27,32.26 114.81,32.26 114.3,31.75
  Bottom 0.61: M5.3 87.4,14.38 87.4,15.98 86.87,16.51 86.87,22.61 86.36,23.11 83.31,23.11 82.55,23.88 82.55,27.94 83.82,29.21 U$3.7
SEG_C  (via drill 0.41)
  Top 0.61: U$4.4 109.22,15.75 107.31,13.84 | U$1.4 17.78,19.56 18.54,20.32 v48.26,20.32 v78.74,20.32 v109.22,20.32 v139.7,20.32 | U$2.4 48.26,14.48 49.28,13.46 53.98,13.46 JP11.1
  Top 0.813: 107.31,13.84 JP8.1
  Bottom 0.61: U$2.4 v48.26,20.32 | U$3.4 v78.74,20.32 | U$4.4 v109.22,20.32 | U$5.4 v139.7,20.32
SEG_C_SOURCE
  Bottom 0.406: 102.62,14.73 101.09,14.73
  Bottom 0.61: 102.62,14.73 JP10.1 | M6.3 95.91,14.73 101.09,14.73
SEG_D  (via drill 0.41, 0.51)
  Top 0.61: U$5.2 134.62,15.75 v136.53,13.84 | U$1.2 12.7,21.08 13.97,22.35 v43.18,22.35 v72.39,22.35 v104.14,22.35 v134.62,22.35
  Bottom 0.61: M7.3 135.51,13.84 v136.53,13.84 | U$2.2 v43.18,22.35 | U$3.2 73.66,18.29 72.39,19.56 v72.39,22.35 | U$4.2 v104.14,22.35 | U$5.2 v134.62,22.35
SEG_DP  (via drill 0.41)
  Top 0.61: U$1.3 15.24,19.81 16.76,21.34 v45.72,21.34 v63.25,21.34 v76.2,21.34 v106.68,21.34 v137.16,21.34 | JP12.1 60.58,12.57 v63.25,15.24 | U$4.3 106.68,16 105.66,14.99 103.38,14.99 JP9.1
  Bottom 0.61: U$2.3 v45.72,21.34 | v63.25,15.24 v63.25,21.34 | U$3.3 v76.2,21.34 | v106.68,21.34 U$4.3 | U$5.3 v137.16,21.34
SEG_DP_SOURCE
  Bottom 0.406: 63.63,11.18 63.63,11.3 60.71,14.22
  Bottom 0.61: M11.3 72.39,9.53 72.01,9.14 67.31,9.14 66.55,9.91 66.17,9.91 65.41,10.67 64.14,10.67 63.63,11.18 | 60.71,14.22 59.05,14.22 JP7.1
SEG_E  (via drill 0.41, 0.51)
  Top 0.61: U$1.1 10.16,17.02 11.94,15.24 21.21,15.24 v22.61,13.84 23.11,14.35 23.11,14.48 25.91,17.27 U$2.1 | v24.64,23.37 24.89,23.62 v71.12,23.62 v101.6,23.62 v132.08,23.62
  Bottom 0.254: 19.96,13.11 19.94,13.11
  Bottom 0.61: 19.96,13.11 20.95,14.1 22.35,14.1 v22.61,13.84 24.64,15.88 v24.64,23.37 | 19.94,13.11 19.94,12.19 M8.3 | v71.12,23.62 U$3.1 | U$4.1 v101.6,23.62 | v132.08,23.62 U$5.1
SEG_F  (via drill 0.41, 0.51)
  Top 0.61: v16.76,12.7 16.76,12.95 18.92,12.95 19.56,12.32 19.56,8.76 20.07,8.26 27.69,8.26 v28.45,9.02 | U$2.10 45.72,28.45 | U$5.10 137.16,27.69 136.4,26.92 v107.44,26.92 v76.2,26.92 47.24,26.92 45.72,28.45 | 45.72,28.45 43.69,26.42 16,26.42 15.24,27.18 U$1.10
  Bottom 0.61: M9.3 31.62,8.26 31.37,8.51 28.96,8.51 v28.45,9.02 | U$1.10 15.24,29.21 12.45,26.42 12.45,23.37 8.64,19.56 8.64,16.26 9.65,15.24 14.22,15.24 v16.76,12.7 | v76.2,26.92 U$3.10 | U$4.10 106.68,27.69 v107.44,26.92
SEG_G  (via drill 0.41)
  Top 0.61: v72.39,14.99 79.25,14.99 81.28,17.02 U$3.5 81.28,19.3 | 50.8,18.54 U$2.5 50.8,19.18 50.93,19.3 | 81.28,19.3 50.93,19.3 | 50.93,19.3 21.34,19.3 20.32,18.29 U$1.5 | U$4.5 111.76,19.3 | 111.76,19.3 81.28,19.3 | U$5.5 142.24,18.8 141.73,19.3 111.76,19.3
  Bottom 0.61: 66.78,11.33 M10.3 67.69,10.41 69.22,10.41 72.39,13.59 v72.39,14.99

### Text on the board
bPlace: /profiles/Jens_G | /profiles/Jens_G | https:/ /oshpark.com | CERN OHL v.1.2 | source | open